# EAGLE design JMDuino (EAGLE 7.2.0)
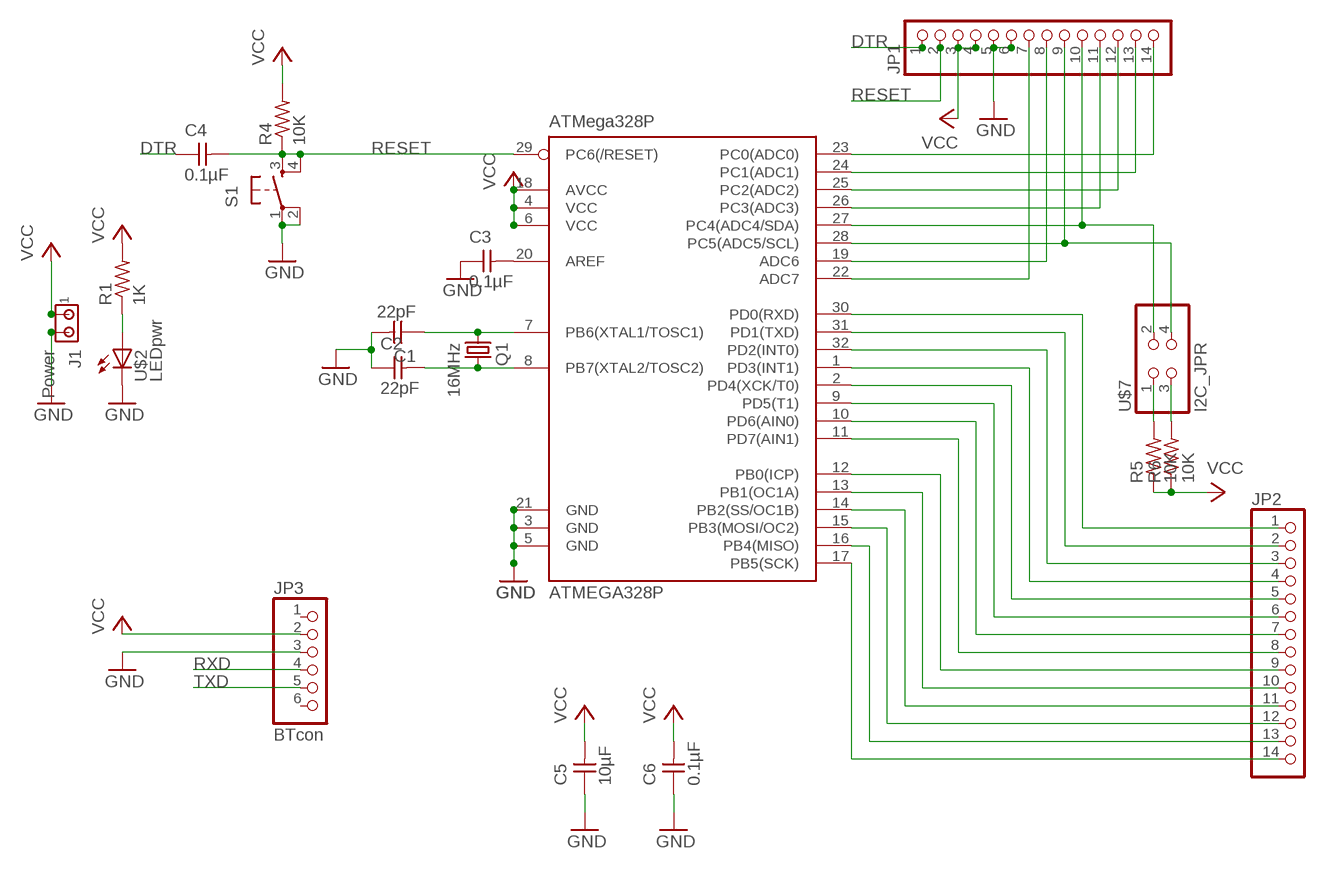
[diagram p0: schematic, sheet 1]

## Parts
ATMEGA328P  ATMega328P  ATMEGA88-THIN  [TQFP32-08THIN]
C1  22pF  CAP-UNPOLARIZEDFAB  [C1206FAB]
C2  22pF  CAP-UNPOLARIZEDFAB  [C1206FAB]
C3  0.1µF  CAP-UNPOLARIZEDFAB  [C1206FAB]
C4  0.1µF  CAP-UNPOLARIZEDFAB  [C1206FAB]
C5  10µF  CAP-UNPOLARIZEDFAB  [C1206FAB]
C6  0.1µF  CAP-UNPOLARIZEDFAB  [C1206FAB]
J1  Power  350428-1  [350428-1]
JP1  PINHD-1X14  [1X14]
JP2  PINHD-1X14  [1X14]
JP3  BTcon  PINHD-1X6  [1X06]
Q1  16MHz  CRYSTAL  [2-SMD-5X3MM]
R1  1K  RES-US1206FAB  [R1206FAB]
R4  10K  RES-US1206FAB  [R1206FAB]
R5  10K  RES-US1206FAB  [R1206FAB]
R6  10K  RES-US1206FAB  [R1206FAB]
S1  6MM_SWITCH6MM_SWITCH  [6MM_SWITCH]
U$2  LEDpwr  LEDFAB1206  [LED1206FAB]
U$7  I2C_JPR  PINHD-2X2-SMD  [2X02SMD]

## Nets
DTR: C4.1 JP1.1
GND: ATMEGA328P.3(GND) ATMEGA328P.5(GND) ATMEGA328P.21(GND) C1.2 C2.1 C3.1 C5.1 C6.1 J1.2 JP1.5 JP1.6 JP3.3 S1.1(P) S1.2(P1) U$2.2(C)
MISO: ATMEGA328P.16(PB4(MISO)) JP2.13
MOSI: ATMEGA328P.15(PB3(MOSI/OC2)) JP2.12
N$1: ATMEGA328P.23(PC0(ADC0)) JP1.14
N$2: ATMEGA328P.24(PC1(ADC1)) JP1.13
N$3: ATMEGA328P.25(PC2(ADC2)) JP1.12
N$4: ATMEGA328P.26(PC3(ADC3)) JP1.11
N$5: ATMEGA328P.20(AREF) C3.2
N$6: ATMEGA328P.27(PC4(ADC4/SDA)) JP1.10 U$7.2
N$7: ATMEGA328P.9(PD5(T1)) JP2.6
N$8: ATMEGA328P.28(PC5(ADC5/SCL)) JP1.9 U$7.4
N$10: ATMEGA328P.32(PD2(INT0)) JP2.3
N$11: ATMEGA328P.1(PD3(INT1)) JP2.4
N$12: ATMEGA328P.2(PD4(XCK/T0)) JP2.5
N$13: ATMEGA328P.10(PD6(AIN0)) JP2.7
N$14: ATMEGA328P.11(PD7(AIN1)) JP2.8
N$15: ATMEGA328P.12(PB0(ICP)) JP2.9
N$16: ATMEGA328P.13(PB1(OC1A)) JP2.10
N$17: ATMEGA328P.14(PB2(SS/OC1B)) JP2.11
N$18: R1.1 U$2.1(A)
N$20: R5.2 U$7.1
N$21: ATMEGA328P.7(PB6(XTAL1/TOSC1)) C1.1 Q1.P$1
N$22: ATMEGA328P.8(PB7(XTAL2/TOSC2)) C2.2 Q1.P$2
N$23: ATMEGA328P.19(ADC6) JP1.8
N$24: R6.2 U$7.3
N$25: ATMEGA328P.22(ADC7) JP1.7
RESET: ATMEGA328P.29(PC6(/RESET)) C4.2 JP1.2 R4.1 S1.4(S1)
RXD: ATMEGA328P.30(PD0(RXD)) JP2.1 JP3.4
SCK: ATMEGA328P.17(PB5(SCK)) JP2.14
TXD: ATMEGA328P.31(PD1(TXD)) JP2.2 JP3.5
VCC: ATMEGA328P.4(VCC) ATMEGA328P.6(VCC) ATMEGA328P.18(AVCC) C5.2 C6.2 J1.1 JP1.3 JP1.4 JP3.2 R1.2 R4.2 R5.1 R6.1
Unconnected: JP3.1 JP3.6 S1.3(S)

## Library data of the parts
ATMEGA328P = fab:ATMEGA88-THIN
C1-C6 = fab:CAP-UNPOLARIZED
J1 = con-amp:350428-1: Universal MATE-N-LOK .250" Centerline, 600 V, 19 - 36 A max Source: http://catalog.tycoelectronics.com/ .. ENG_CD_350428_Y.pdf
JP1 JP2 = adafruit:PINHD-1X14: PIN HEADER
JP3 = adafruit:PINHD-1X6: PIN HEADER
Q1 = fab:CRYSTAL
R1 R4-R6 = fab:RES-US: Resistor (US Symbol) Variants with postfix FAB are widened to allow the routing of internal traces
S1 = fab:6MM_SWITCH: OMRON SWITCH
U$2 = fab:LED: LED
U$7 = fab:PINHD-2X2-SMD

## Board
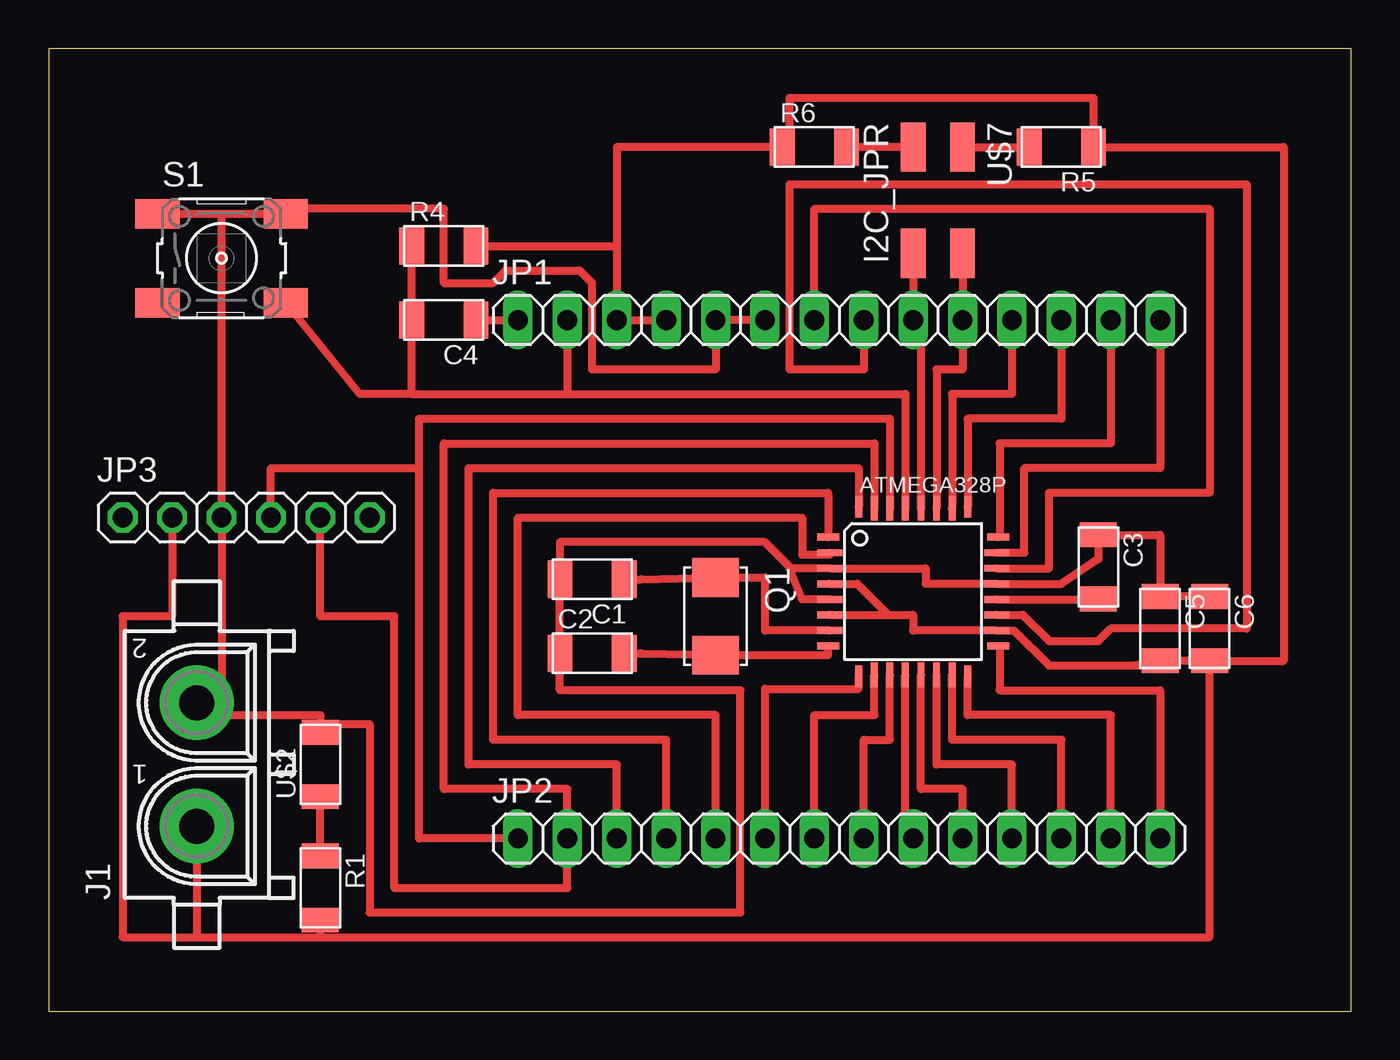
[diagram p1: board, top side]

Size 66.98 x 49.52 mm. Coordinates in mm from the lower left corner, seen from the top.
Outline: 0,0 66.98,0 66.98,49.52 0,49.52 0,0
Copper layers (1*16): Top 0.035mm / dielectric 1.5mm / Bottom 0.035mm
Design rules "default": minimum track width 10mil, minimum drill 24mil, track to track 8mil, track to pad 8mil, pad to pad 8mil, via to via 8mil, smd to smd 8mil, copper to edge 40mil, drill to drill 8mil, minimum pad ring 10mil, minimum via ring 8mil, stop-mask expansion 4mil, vias tented up to drill 0mil, thermal gap 10mil

### Footprints (pad centres in the part's own frame; a part is rotated, then mirrored left to right if it is on the bottom)
TQFP32-08THIN = smd 1.118 x 0.356: 1 -4.369,2.8; 8 -4.369,-2.8; 17 4.369,-2.8; 24 4.369,2.8 | smd 1.27 x 0.356: 2 -4.293,2; 3 -4.293,1.2; 4 -4.293,0.4; 5 -4.293,-0.4; 6 -4.293,-1.2; 7 -4.293,-2; 18 4.293,-2; 19 4.293,-1.2; 20 4.293,-0.4; 21 4.293,0.4; 22 4.293,1.2; 23 4.293,2 | smd 0.356 x 1.118: 9 -2.8,-4.369; 16 2.8,-4.369; 25 2.8,4.369; 32 -2.8,4.369 | smd 0.356 x 1.27: 10 -2,-4.293; 14 1.2,-4.293; 15 2,-4.293; 26 2,4.293; 27 1.2,4.293; 31 -2,4.293 | smd 0.35 x 1.27: 11 -1.2,-4.293; 12 -0.4,-4.293; 13 0.4,-4.293; 28 0.4,4.293; 29 -0.4,4.293; 30 -1.2,4.293
C1206FAB = smd 1.27 x 1.905: 1 -1.651,0; 2 1.651,0
350428-1 = drill 1.8 pad 3.81: 1 -3.175,0; 2 3.175,0
1X14 = drill 1.016 long: 1 -16.51,0; 2 -13.97,0; 3 -11.43,0; 4 -8.89,0; 5 -6.35,0; 6 -3.81,0; 7 -1.27,0; 8 1.27,0; 9 3.81,0; 10 6.35,0; 11 8.89,0; 12 11.43,0; 13 13.97,0; 14 16.51,0
1X06 = drill 1.016 octagon: 1 -6.35,0; 2 -3.81,0; 3 -1.27,0; 4 1.27,0; 5 3.81,0; 6 6.35,0
2-SMD-5X3MM = smd 2 x 2.4: P$1 -2,0; P$2 2,0
R1206FAB = smd 1.27 x 1.905: 1 -1.651,0; 2 1.651,0
6MM_SWITCH = smd 2.286 x 1.524: 1 -3.302,2.286; 2 3.302,2.286; 3 -3.302,-2.286; 4 3.302,-2.286
LED1206FAB = smd 1.27 x 1.905: 1 -1.651,0; 2 1.651,0
2X02SMD = smd 2.54 x 1.27: 1 -2.54,1.27; 2 2.92,1.27; 3 -2.54,-1.27; 4 2.92,-1.27

### Placement (x,y rotation side)
ATMEGA328P  44.45,21.59 0 top
C1  27.94,22.23 180 top
C2  27.94,18.41 0 top
C3  53.98,22.86 270 top
C4  20.32,35.56 180 top
C5  57.15,19.69 270 top
C6  59.69,19.69 270 top
J1  7.62,12.7 90 top
JP1  40.64,35.56 0 top
JP2  40.64,8.89 0 top
JP3  10.16,25.4 0 top
Q1  34.29,20.32 270 top
R1  13.97,6.35 270 top
R4  20.32,39.37 0 top
R5  52.07,44.45 180 top
R6  39.37,44.45 0 top
S1  8.89,38.73 0 top
U$2  13.97,12.7 90 top
U$7  45.72,41.91 270 top

### Tracks (layer width: path | path; a pad name or v marks a point on that pad's centre or on a via)
DTR
  Top 0.406: C4.1 JP1.1
GND
  Top 0.406: ATMEGA328P.5 38.73,21.19 38.1,22.79 | 38.1,22.79 ATMEGA328P.3 45.09,22.79 45.09,21.99 ATMEGA328P.21 52.07,21.99 53.98,23.26 C3.1 57.15,24.51 C5.1 C6.1 | 38.1,22.79 38.1,22.86 36.83,24.13 26.29,24.13 C1.2 C2.1 26.29,16.51 35.56,16.51 35.56,5.08 16.51,5.08 16.51,14.76 13.97,14.76 U$2.2 13.97,15.24 8.89,15.24 | JP1.6 JP1.5 34.29,33.02 27.94,33.02 27.94,37.46 27.3,38.1 23.49,38.1 22.86,37.46 20.32,37.46 20.32,41.27 12.45,41.27 S1.2 8.89,41.02 | S1.1 8.89,41.02 | 8.89,41.02 JP3.3 8.89,15.24 | 8.89,15.24 7.62,15.24 J1.2
MISO
  Top 0.406: JP2.13 54.61,15.24 47.25,15.24 ATMEGA328P.16
MOSI
  Top 0.406: JP2.12 52.07,13.97 46.45,13.97 ATMEGA328P.15
N$1
  Top 0.406: ATMEGA328P.23 50.16,23.59 50.16,27.94 57.15,27.94 JP1.14
N$2
  Top 0.406: JP1.13 54.61,29.21 48.9,29.21 48.9,24.47 ATMEGA328P.24
N$3
  Top 0.406: JP1.12 52.07,30.48 47.25,30.48 ATMEGA328P.25
N$4
  Top 0.406: JP1.11 49.53,31.75 46.45,31.75 ATMEGA328P.26
N$5
  Top 0.406: ATMEGA328P.20 52.96,21.19 C3.2
N$6
  Top 0.406: ATMEGA328P.27 45.65,33.02 46.99,33.02 JP1.10 U$7.2
N$7
  Top 0.406: JP2.6 36.83,16.59 41.65,16.59 ATMEGA328P.9
N$8
  Top 0.406: ATMEGA328P.28 44.85,35.56 JP1.9 U$7.4
N$10
  Top 0.406: JP2.3 29.21,12.7 21.59,12.7 21.59,27.94 41.65,27.94 ATMEGA328P.32
N$11
  Top 0.406: JP2.4 31.75,13.97 22.86,13.97 22.86,26.67 40.08,26.67 ATMEGA328P.1
N$12
  Top 0.406: JP2.5 34.29,15.24 24.13,15.24 24.13,25.4 38.73,25.4 38.73,23.49 40.16,23.49 ATMEGA328P.2
N$13
  Top 0.406: JP2.7 39.37,15.24 42.45,15.24 ATMEGA328P.10
N$14
  Top 0.406: JP2.8 41.91,13.97 43.25,13.97 ATMEGA328P.11
N$15
  Top 0.406: JP2.9 44.05,8.89 ATMEGA328P.12
N$16
  Top 0.406: JP2.10 46.99,11.43 44.85,11.43 ATMEGA328P.13
N$17
  Top 0.406: JP2.11 49.53,12.7 45.65,12.7 ATMEGA328P.14
N$18
  Top 0.406: R1.1 U$2.1
N$20
  Top 0.406: U$7.1 R5.2
N$21
  Top 0.406: C1.1 30.48,22.23 Q1.P$1 36.83,22.32 36.83,19.59 ATMEGA328P.7
N$22
  Top 0.406: C2.2 30.48,18.41 Q1.P$2 40.08,18.32 ATMEGA328P.8
N$23
  Top 0.406: ATMEGA328P.19 50.1,20.39 51.44,19.05 53.98,19.05 54.61,19.69 61.6,19.69 61.6,42.55 38.1,42.55 38.1,33.02 41.91,33.02 JP1.8
N$24
  Top 0.406: U$7.3 R6.2
N$25
  Top 0.406: ATMEGA328P.22 51.44,22.79 51.44,26.67 59.69,26.67 59.69,41.27 39.37,41.27 JP1.7
RESET
  Top 0.406: 18.67,31.75 26.67,31.75 | 26.67,31.75 44.05,31.75 ATMEGA328P.29 | 18.67,31.75 C4.2 R4.1 | 18.67,31.75 16,31.75 S1.4 | JP1.2 26.67,31.75
RXD
  Top 0.406: JP2.1 19.05,8.89 19.05,27.94 | 19.05,27.94 19.05,30.48 43.25,30.48 ATMEGA328P.30 | JP3.4 11.43,27.94 19.05,27.94
SCK
  Top 0.406: ATMEGA328P.17 48.9,18.79 48.9,16.51 57.15,16.51 JP2.14
TXD
  Top 0.406: ATMEGA328P.31 42.45,29.21 20.32,29.21 20.32,11.43 26.67,11.43 JP2.2 26.67,6.35 17.78,6.35 17.78,20.32 13.97,20.32 JP3.5
VCC
  Top 0.406: ATMEGA328P.6 43.18,20.39 | 43.18,20.39 44.45,20.39 44.45,19.59 ATMEGA328P.18 49.62,19.59 51.44,17.78 55.88,17.78 | ATMEGA328P.4 41.58,21.99 43.18,20.39 | 55.88,17.78 57.53,17.78 | 55.88,17.78 C5.2 C6.2 | C6.2 63.5,18.03 63.5,44.45 R5.1 53.72,46.99 38.1,46.99 38.1,44.45 R6.1 29.21,44.45 29.21,39.37 | 13.97,3.81 59.69,3.81 C6.2 | R4.2 29.21,39.37 | JP3.2 6.35,20.32 3.81,20.32 3.81,3.81 7.62,3.81 | 7.62,3.81 13.97,3.81 | R1.2 13.97,3.81 | 29.21,39.37 JP1.3 JP1.4 | J1.1 7.62,3.81